# EAGLE design board (EAGLE 6.4)
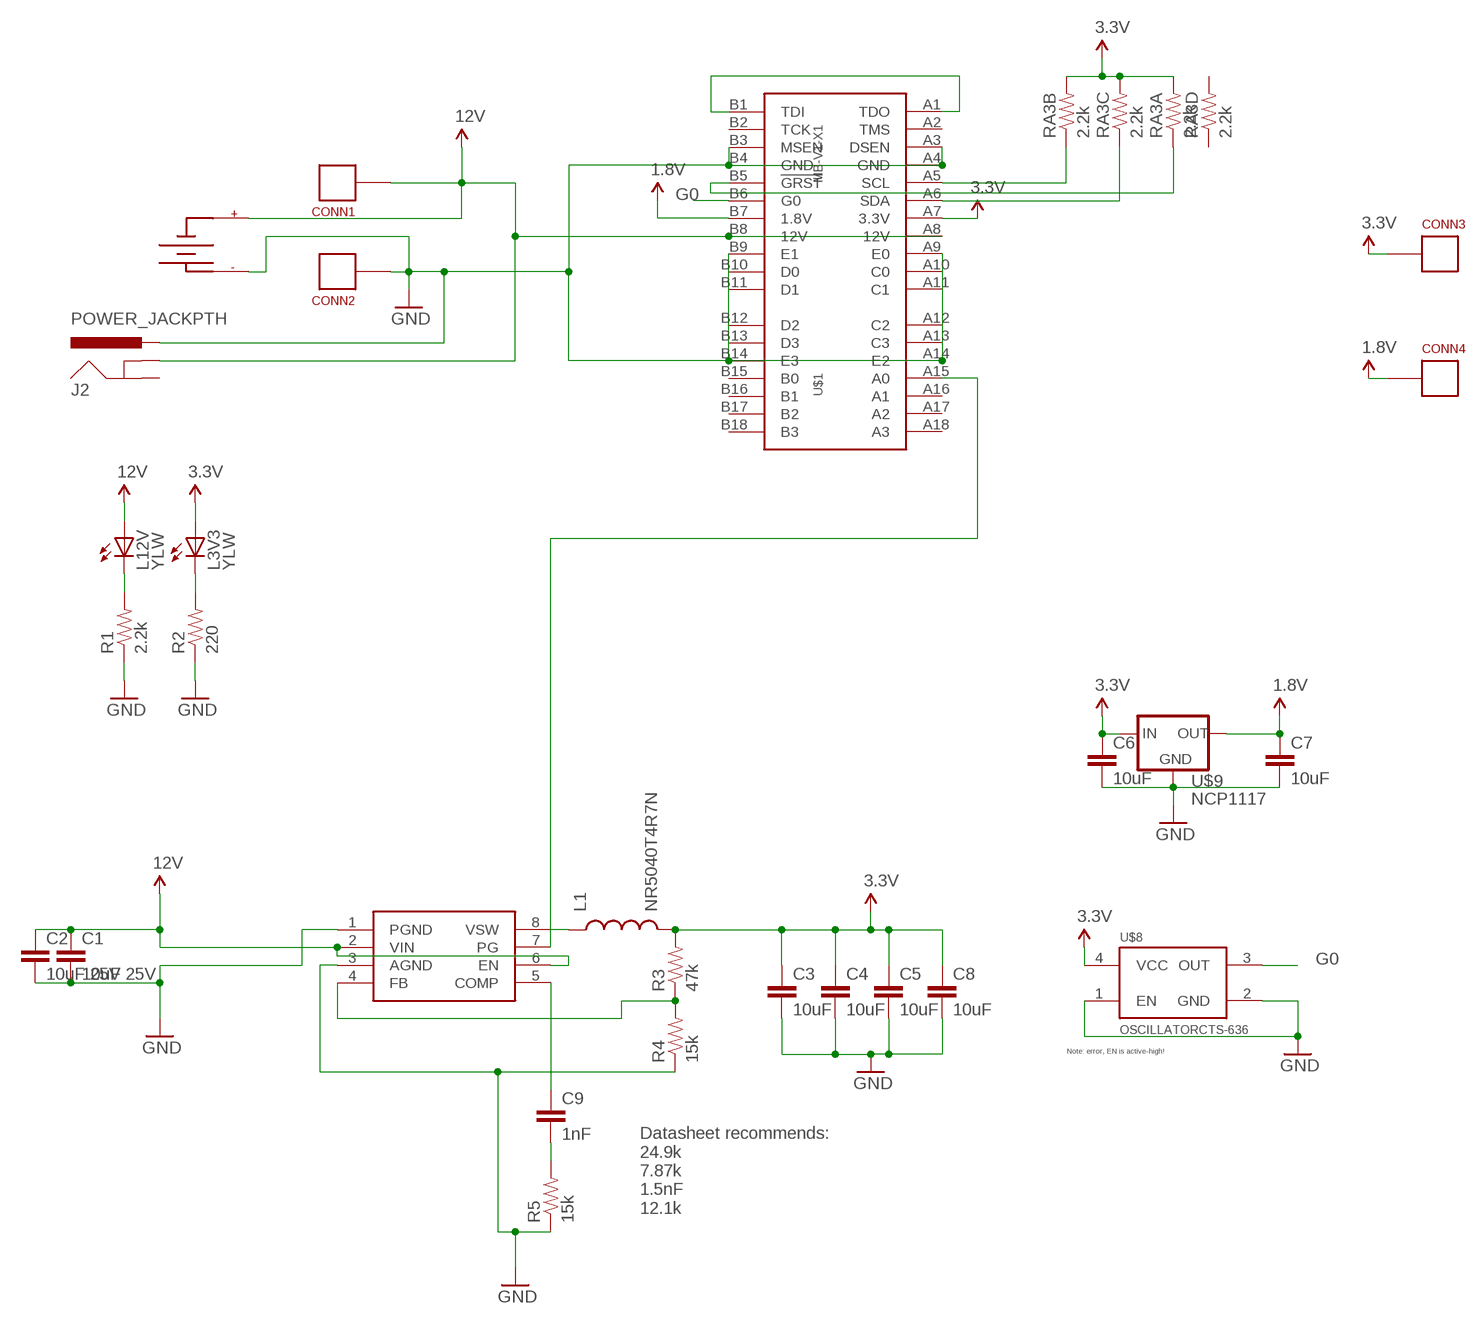
[diagram p0: schematic, sheet 1]

## Parts
C1  10uF 25V  CAP0805  [0805]
C2  10uF 25V  CAP0805  [0805]
C3  10uF  CAP0805  [0805]
C4  10uF  CAP0805  [0805]
C5  10uF  CAP0805  [0805]
C6  10uF  CAP0805  [0805]
C7  10uF  CAP0805  [0805]
C8  10uF  CAP0805  [0805]
C9  1nF  CAP0402-CAP  [0402-CAP]
CONN1  CONNECTOR18AWG  [HOLE_18AWG]
CONN2  CONNECTOR18AWG  [HOLE_18AWG]
CONN3  CONNECTOR18AWG  [HOLE_18AWG]
CONN4  CONNECTOR18AWG  [HOLE_18AWG]
J2  POWER_JACKPTH  [POWER_JACK_PTH]
L1  NR5040T4R7N  INDUCTORNR5040  [NR5040]
L3V3  YLW  LED0603  [0603_LED]
L12V  YLW  LED0603  [0603_LED]
R1  2.2k  RESISTOR0603  [0603-RES]
R2  220  RESISTOR0603  [0603-RES]
R3  47k  RESISTOR0603  [0603-RES]
R4  15k  RESISTOR0603  [0603-RES]
R5  15k  RESISTOR0603  [0603-RES]
RA3  2.2k  RESISTOR_ARRAY0603_X4  [0603-ARV]
U$1  MB-V1-X1  [PCIE-X1-EDGE]
U$4  SUPPLYPCIE-6-RA  [MOLEX_MINIFITJR_6_RA]
U$7  NCP3170  [SO08]
U$8  OSCILLATORCTS-636  [CTS-636]
U$9  NCP1117  VREGSOT223  [SOT223]

## Nets
1.8V: C7.1 CONN4.P$1(P) U$1.B7(1.8V) U$9.2(OUT) U$9.4(OUT)
3.3V: C3.1 C4.1 C5.1 C6.1 C8.1 CONN3.P$1(P) L1.P$2 L3V3.A R3.2 RA3.6 RA3.7 RA3.8 U$1.A7(3.3V) U$8.4(VCC) U$9.3(IN)
12V: C1.1 C2.1 CONN1.P$1(P) J2.GNDBREAK L12V.A U$1.A8(12V) U$1.B8(12V) U$4.1(VSUPPLY) U$4.3(VSUPPLY) U$7.2(VIN) U$7.6(EN)
G0: U$1.B6(G0) U$8.3(OUT)
GND: C1.2 C2.2 C3.2 C4.2 C5.2 C6.2 C7.2 C8.2 CONN2.P$1(P) J2.PWR R1.1 R2.1 R4.1 R5.1 U$1.A3(DSEN) U$1.A4(GND) U$1.A9(E0) U$1.A14(E2) U$1.B3(MSEN) U$1.B4(GND) U$1.B9(E1) U$1.B14(E3) U$4.4(GND) U$4.6(GND) U$7.1(PGND) U$7.3(AGND) U$8.1(EN) U$8.2(GND) U$9.1(GND)
N$1: L12V.C R1.2
N$3: L1.P$1 U$7.8(VSW)
N$4: U$1.A15(A0) U$7.7(PG)
N$5: R3.1 R4.2 U$7.4(FB)
N$6: L3V3.C R2.2
N$7: C9.1 U$7.5(COMP)
N$8: RA3.3 U$1.A6(SDA)
N$9: C9.2 R5.2
N$12: RA3.2 U$1.A5(SCL)
N$13: RA3.1 U$1.B5(!GRST)
TDI: U$1.A1(TDO) U$1.B1(TDI)
Unconnected: J2.GND RA3.4 RA3.5 U$1.A2(TMS) U$1.A10(C0) U$1.A11(C1) U$1.A12(C2) U$1.A13(C3) U$1.A16(A1) U$1.A17(A2) U$1.A18(A3) U$1.B2(TCK) U$1.B10(D0) U$1.B11(D1) U$1.B12(D2) U$1.B13(D3) U$1.B15(B0) U$1.B16(B1) U$1.B17(B2) U$1.B18(B3)

## Notes on the sheet
- Note: error, EN is active-high!
- Datasheet recommends:
  24.9k
  7.87k
  1.5nF
  12.1k

## Library data of the parts
C1-C9 = kmod-passives:CAP: Capacitor Standard 0603 ceramic capacitor, and 0.1" leaded capacitor.
CONN1-CONN4 = kmod-nonparts:CONNECTOR: Collection of holes/pads for testing/connecting
J2 = SparkFun-Connectors:POWER_JACK: Power Jack This is the standard 5.5mm barrel jack for power. The PTH is the most common, proven, reliable, footprint. The Slot footprint only works if the mill layer is transmitted to the PCB fab house so be warned. Spark Fun Electronics SKU : PRT-00119 SMT: CONN-08106 Mating wall wart : TOL-00298 (and others)
L1 = kmod-passives:INDUCTOR
L3V3 L12V = kmod-passives:LED
R1-R5 = kmod-passives:RESISTOR: Resistor Basic schematic elements and footprints for 0603, 1206, and PTH resistors.
RA3 = kmod-passives:RESISTOR_ARRAY
U$1 = kmod-connectors:MB-V1-X1
U$4 = kmod-connectors:SUPPLY
U$7 = kmod-ics:NCP3170: NCP3170 3A buck converter
U$8 = kmod-mechanical:OSCILLATOR
U$9 = kmod-ics:VREG

## Board
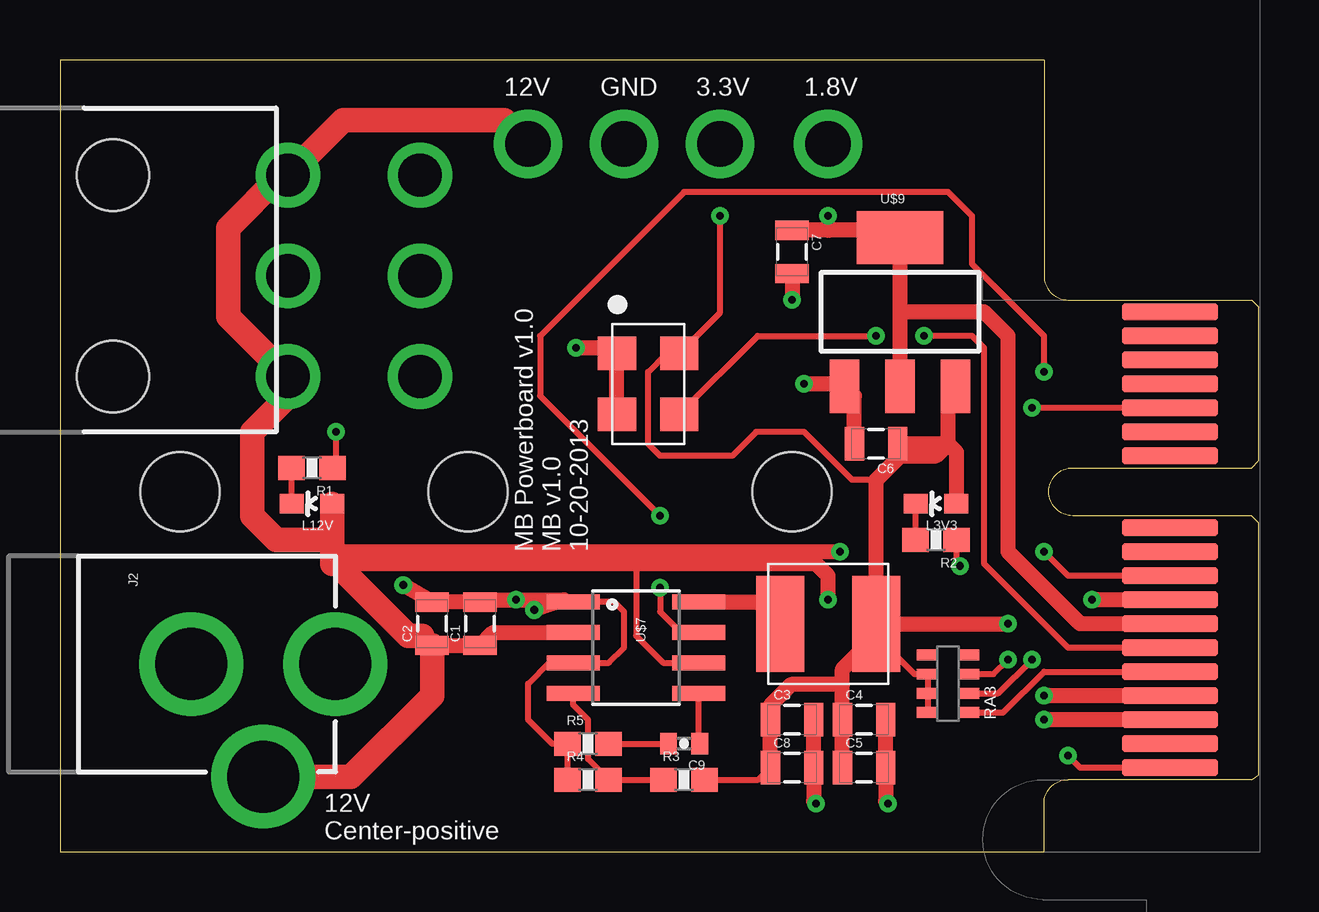
[diagram p1: board, top side]
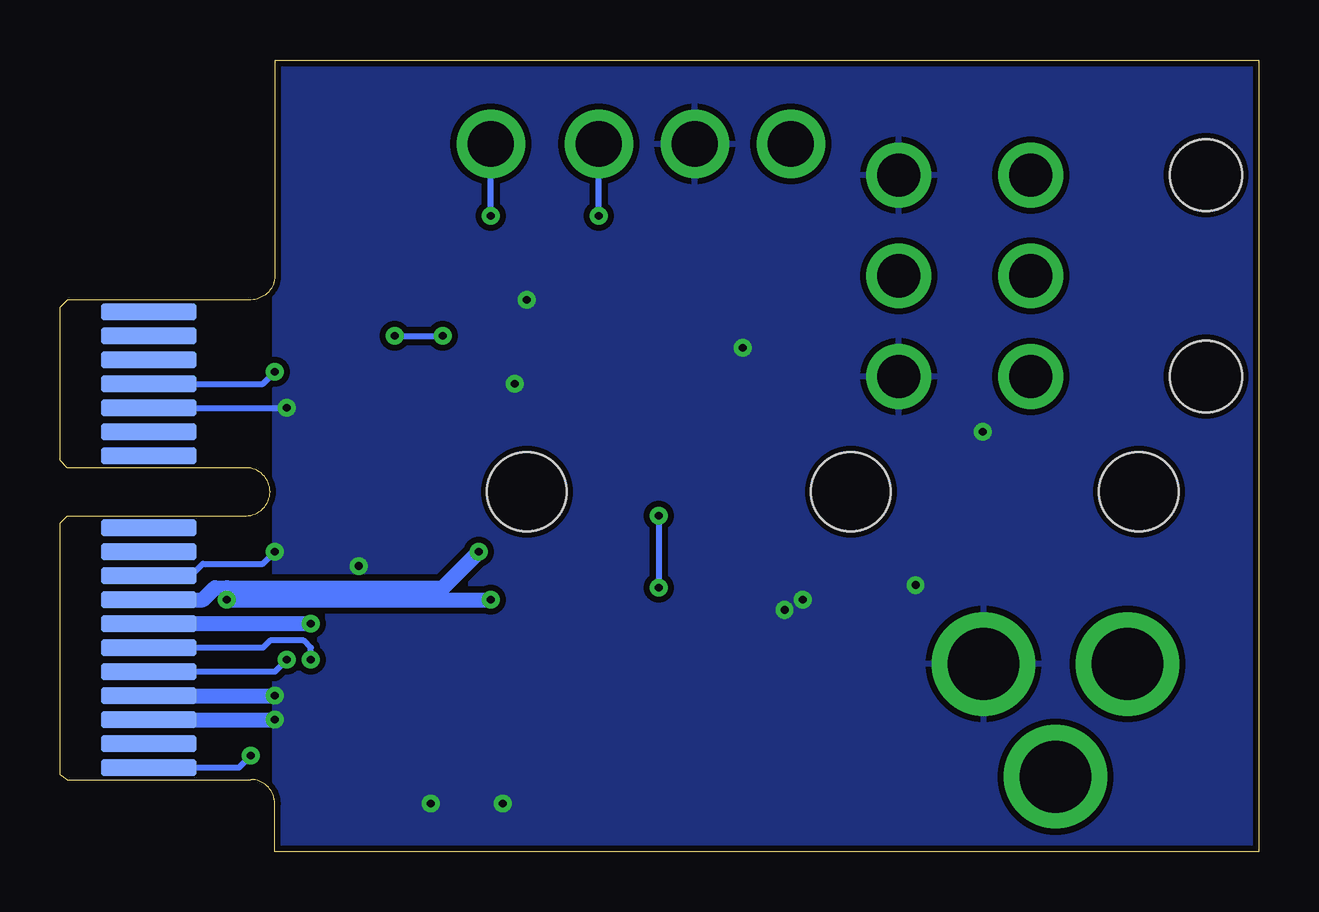
[diagram p2: board, bottom side, seen from below]

Size 49.95 x 33 mm. Coordinates in mm from the lower left corner, seen from the top.
Outline: 42,3 arc90 41,2 41,0 0,0 0,33 41,33 41,24 arc90 42,23
Copper layers (1*16): Top 0.035mm / dielectric 1.5mm / Bottom 0.035mm
Design rules "SeeedStudio_mine": minimum track width 6mil, minimum drill 12mil, track to track 6mil, track to pad 6mil, pad to pad 6mil, via to via 6mil, smd to smd 6mil, copper to edge 10mil, drill to drill 10mil, minimum pad ring 6mil, minimum via ring 8mil, stop-mask expansion 2mil, vias tented up to drill 25mil, thermal gap 10mil
Holes 3.3 mm at 5,15 17,15 30.5,15

### Footprints (pad centres in the part's own frame; a part is rotated, then mirrored left to right if it is on the bottom)
0805 = smd 0.8 x 1.4: 1 -0.9,0; 2 0.9,0
0402-CAP = smd 0.7 x 0.9: 1 -0.65,0; 2 0.65,0
HOLE_18AWG = drill 1.905: P$1 0,0
POWER_JACK_PTH = drill 2.997 pad 4.318: GND 0,7.7; GNDBREAK 4.7,10.7; PWR 0,13.7
NR5040 = smd 2 x 4: P$1 2,0; P$2 -2,0
0603_LED = smd 0.8 x 1.003: A 0,-0.852; C 0,0.852
0603-RES = smd 1.1 x 1: 1 -0.85,0; 2 0.85,0
0603-ARV = smd 0.45 x 0.9: 1 -1.2,-0.85; 2 -0.4,-0.85; 3 0.4,-0.85; 4 1.2,-0.85; 5 1.2,0.85; 6 0.4,0.85; 7 -0.4,0.85; 8 -1.2,0.85
PCIE-X1-EDGE = smd 0.7 x 4 bottom: A1 -11.5,-0.75; A2 -10.5,-0.75; A3 -9.5,-0.75; A4 -8.5,-0.75; A5 -7.5,-0.75; A6 -6.5,-0.75; A7 -5.5,-0.75; A8 -4.5,-0.75; A9 -3.5,-0.75; A10 -2.5,-0.75; A11 -1.5,-0.75; A12 1.5,-0.75; A13 2.5,-0.75; A14 3.5,-0.75; A15 4.5,-0.75; A16 5.5,-0.75; A17 6.5,-0.75; A18 7.5,-0.75 | smd 0.7 x 4: B1 -11.5,-0.75; B2 -10.5,-0.75; B3 -9.5,-0.75; B4 -8.5,-0.75; B5 -7.5,-0.75; B6 -6.5,-0.75; B7 -5.5,-0.75; B8 -4.5,-0.75; B9 -3.5,-0.75; B10 -2.5,-0.75; B11 -1.5,-0.75; B12 1.5,-0.75; B13 2.5,-0.75; B14 3.5,-0.75; B15 4.5,-0.75; B16 5.5,-0.75; B17 6.5,-0.75; B18 7.5,-0.75
MOLEX_MINIFITJR_6_RA = drill 1.8: 1 4.2,0; 2 0,0; 3 -4.2,0; 4 4.2,5.5; 5 0,5.5; 6 -4.2,5.5 | hole 3: -4.2,-7.3; 4.2,-7.3
SO08 = smd 0.61 x 2.21: 1 -1.905,-2.616; 2 -0.635,-2.616; 3 0.635,-2.616; 4 1.905,-2.616; 5 1.905,2.616; 6 0.635,2.616; 7 -0.635,2.616; 8 -1.905,2.616
CTS-636 = smd 1.4 x 1.6: 1 -1.27,-1.3; 2 1.27,-1.3; 3 1.27,1.3; 4 -1.27,1.3
SOT223 = smd 1.219 x 2.235: 1 -2.311,-3.099; 2 0,-3.099; 3 2.311,-3.099 | smd 3.6 x 2.2: 4 0,3.099

### Placement (x,y rotation side)
C1  17.5,9.5 90 top
C2  15.5,9.5 90 top
C3  30.5,5.5 0 top
C4  33.5,5.5 0 top
C5  33.5,3.5 0 top
C6  34,17 180 top
C7  30.5,25 270 top
C8  30.5,3.5 0 top
C9  26,4.5 180 top
CONN1  19.5,29.5 90 top
CONN2  23.5,29.5 90 top
CONN3  27.5,29.5 0 top
CONN4  32,29.5 0 top
J2  -2.23,7.82 270 top
L1  32,9.5 180 top
L3V3  36.5,14.5 90 top
L12V  10.5,14.5 90 top
R1  10.5,16 180 top
R2  36.5,13 180 top
R3  26,3 0 top
R4  22,3 0 top
R5  22,4.5 0 top
RA3  37,7 90 top
U$1  45.5,15 90 top
U$4  9.5,24 270 top
U$7  24,8.5 270 top
U$8  24.5,19.5 270 top
U$9  35,22.5 0 top

### Tracks (layer width: path | path; a pad name or v marks a point on that pad's centre or on a via)
1.8V  (via drill 0.33)
  Top 0.254: 32.02,25.9 32.02,26.48 v32,26.5
  Top 0.635: U$9.2 35,22.5 | 35,22.5 U$9.4 34.7,25.9 32.02,25.9 C7.1 | U$1.B7 42.5,9.5 39.5,12.5 39.5,21.5 38.5,22.5 35,22.5
  Bottom 0.254: v32,26.5 CONN4.P$1
3.3V  (via drill 0.33)
  Top 0.254: R3.2 29.1,3 C8.1 | 34,9 35.6,7.4 RA3.6 RA3.7 RA3.8 | 34,15.5 33,15.5 31,17.5 29,17.5 28,16.5 25,16.5 24.5,17 24.5,20 25.27,20.77 U$8.4 27.5,22.47 v27.5,26.5
  Top 0.635: C8.1 C3.1 29.6,6.1 30.46,6.96 32.6,6.96 | C5.1 C4.1 32.6,6.96 | 32.6,6.96 32.6,7.6 34,9 L1.P$2 | L1.P$2 v39.5,9.5 | L1.P$2 34,15.5 35,16.5 36.5,16.5 37,17 | 37,17 C6.1 | 37,17 37,19.09 U$9.3 | 37,17 37.35,16.65 L3V3.A
  Bottom 0.254: v27.5,26.5 CONN3.P$1
  Bottom 0.635: v39.5,9.5 U$1.A7
12V  (via drill 0.33)
  Top 0.254: 24,12 24,9 25.14,7.87 U$7.6
  Top 0.635: U$1.A8 v43,10.5 | v32,10.5 32,11.5 31.5,12 28.5,12 | v32.5,12.5 28,12.5 | U$4.3 9.2,28.2 | 11.35,13.75 11.1,13.5 | U$7.2 18.04,9.13 C1.1 C2.1 15.1,9 | 11.85,11.65 11.35,12 24,12 28.5,12 | 28.5,12 28,12.5 | 28,12.5 11.5,12.5
  Top 1.016: 9.2,28.2 7,26 7,22.3 U$4.1 9.5,19 8,17.5 8,14 9,13 11.35,13 | J2.GNDBREAK 12.12,3.12 15.5,6.5 C2.1 | L12V.A 11.35,13.75 11.35,13 | 15.1,9 14.5,9 11.85,11.65 | 11.35,12 11.35,13 | U$4.3 11.8,30.5 18.5,30.5 CONN1.P$1
  Bottom 0.635: v32,10.5 v43,10.5 43,11 | U$1.A8 44,10.5 43.5,11 43,11 | 43,11 34,11 v32.5,12.5
G0  (via drill 0.33)
  Top 0.254: U$1.B6 42,8.5 38.5,12 38.5,21 38,21.5 v36,21.5 | U$8.3 29.07,21.5 v34,21.5
  Bottom 0.254: v36,21.5 v34,21.5
GND  (via drill 0.33)
  Top 0.254: R4.1 R5.1 20.5,4.5 19.5,5.5 19.5,7 20.36,7.87 U$7.3 22.86,7.87 23.5,8.5 23.5,10 23.09,10.4 U$7.1 | U$7.1 21.29,10.5 | R1.1 11.5,16.15 v11.5,17.5 | R2.1 37.35,12.15 v37.5,11.9 | C1.2 17.6,10.5 | 21,10.5 21.09,10.4 U$7.1 | U$1.B14 v40.5,18.5 | U$1.B9 42,11.5 v41,12.5
  Top 0.635: C3.2 C8.2 31.4,2.1 v31.5,2 | C4.2 C5.2 34.4,2.1 v34.5,2 | C1.2 C2.2 v14.3,11.11 | U$1.B3 v41,5.5 | U$1.A4 v41,6.5 | v31,19.5 32.59,19.5 U$9.1 33.1,18.99 C6.2 | C7.2 v30.5,23 | U$8.2 U$8.1 22.97,21 v21.5,21 | 17.6,10.5 v19,10.5 21,10.5 v19.76,10.07
  Bottom 0.254: U$1.B14 v40.5,18.5 | U$1.B9 44.5,11.5 44,12 41.5,12 v41,12.5
  Bottom 0.635: U$1.B3 v41,5.5 | U$1.A4 v41,6.5
  pour Bottom (isolate 0.254): 0,33 41,33 41,0 0,0
N$1
  Top 0.254: L12V.C R1.2
N$3
  Top 0.635: U$7.8 29.09,10.4 L1.P$1
N$4  (via drill 0.33)
  Top 0.254: v41,20 41,21.5 38,24.5 38,26.5 37,27.5 26,27.5 20,21.5 20,19 v25,14 | v25,11 25,10 25.86,9.13 U$7.7
  Bottom 0.254: U$1.A15 41.5,19.5 v41,20 | v25,14 v25,11
N$5
  Top 0.254: R3.1 R4.2 22,3.85 22,5.5 21.38,6.12 U$7.4
N$6
  Top 0.254: R2.2 L3V3.C
N$7
  Top 0.254: C9.1 26.62,4.53 U$7.5
N$8  (via drill 0.33)
  Top 0.254: RA3.3 38.9,7.4 v39.5,8
  Bottom 0.254: v39.5,8 39.5,8.5 39.8,8.8 41.2,8.8 41.5,8.5 U$1.A6
N$9
  Top 0.254: R5.2 C9.2
N$12  (via drill 0.33)
  Top 0.254: RA3.2 39.1,6.6 v40.5,8
  Bottom 0.254: U$1.A5 41,7.5 v40.5,8
N$13
  Top 0.254: RA3.1 39.3,5.8 41,7.5 U$1.B5
TDI  (via drill 0.33)
  Top 0.254: U$1.B1 42.5,3.5 v42,4
  Bottom 0.254: v42,4 42.5,3.5 U$1.B1

### Text on the board
tPlace: 12V | GND | 3.3V | 1.8V | MB Powerboard v1.0 / MB v1.0 / 10-20-2013 | 12V / Center-positive